# EAGLE design brauholic_v3.2 (EAGLE 6.4)
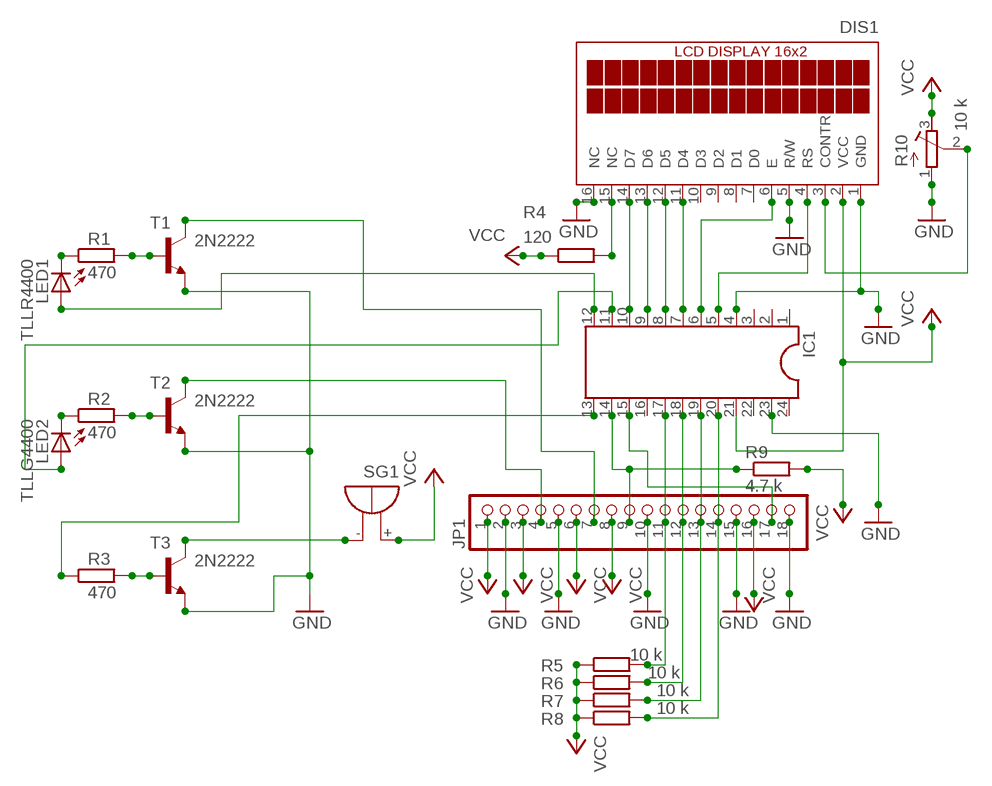
[diagram p0: schematic, sheet 1]

## Parts
DIS1  TUXGR_16X2_R2  [TUXGR_16X2_R2]
IC1  DIL24-6  [DIL24-6]
JP1  PINHD-1X18  [1X18]
LED1  TLLR4400  [LED3MM]
LED2  TLLG4400  [LED3MM]
R1  470  R-EU_0207/10  [0207/10]
R2  470  R-EU_0207/10  [0207/10]
R3  470  R-EU_0207/12  [0207/12]
R4  120  R-EU_0207/10  [0207/10]
R5  10 k  R-EU_0207/10  [0207/10]
R6  10 k  R-EU_0207/10  [0207/10]
R7  10 k  R-EU_0207/10  [0207/10]
R8  10 k  R-EU_0207/10  [0207/10]
R9  4.7 k  R-EU_0207/12  [0207/12]
R10  10 k  R-TRIMM3339P  [RTRIM3339P]
SG1  F/TMB  [F/TMB]
T1  2N2222  -NPN-TO92-EBC  [TO92-EBC]
T2  2N2222  -NPN-TO92-EBC  [TO92-EBC]
T3  2N2222  -NPN-TO92-EBC  [TO92-EBC]

## Nets
GND: DIS1.1(GND) DIS1.5(R/W) DIS1.16(NC) IC1.4 IC1.23 JP1.2 JP1.5 JP1.10 JP1.15 JP1.18 R10.1(E) T1.E T2.E T3.E
N$1: R1.2 T1.B
N$2: R2.2 T2.B
N$3: R3.2 T3.B
N$4: IC1.12 LED1.A
N$5: LED1.K(C) R1.1
N$6: IC1.13 R3.1
N$7: DIS1.14(D7) IC1.10
N$8: DIS1.13(D6) IC1.9
N$9: DIS1.12(D5) IC1.8
N$10: DIS1.11(D4) IC1.7
N$11: SG1.- T3.C
N$12: IC1.11 LED2.A
N$13: LED2.K(C) R2.1
N$14: JP1.7 T1.C
N$15: JP1.4 T2.C
N$16: IC1.14 JP1.9 R9.1
N$17: DIS1.15(NC) R4.2
N$18: IC1.18 JP1.12 R6.2
N$19: DIS1.3(CONTR) R10.2(S)
N$20: IC1.17 JP1.11 R5.2
N$21: IC1.15 JP1.17
N$22: IC1.19 JP1.13 R7.2
N$23: IC1.20 JP1.14 R8.2
N$25: DIS1.6(E) IC1.6
N$26: DIS1.4(RS) IC1.5
VCC: DIS1.2(VCC) IC1.21 JP1.1 JP1.3 JP1.6 JP1.8 JP1.16 R4.1 R5.1 R6.1 R7.1 R8.1 R9.2 R10.3(A) SG1.+
Unconnected: DIS1.7(D0) DIS1.8(D1) DIS1.9(D2) DIS1.10(D3) IC1.1 IC1.2 IC1.3 IC1.16 IC1.22 IC1.24

## Library data of the parts
DIS1 = display-lcd_2:TUXGR_16X2_R2: Tuxgraphics LCD display 16x2 characters reflective, without background light Source: tuxgr_12x2_r2.pdf; OC_FARNELL: unknown; OC_NEWARK: unknown
IC1 = ic-package:DIL24: Dual In Line
JP1 = pinhead:PINHD-1X18: PIN HEADER
LED1 = led:TLLR4400: Low Current (2mA) LED 3 mm Tinted Diffused Package color RED Source: Data sheet <http://www.farnell.com/datasheets/391100.pdf>; MF: VISHAY SEMICONDUCTOR; OC_FARNELL: 1612437
LED2 = led:TLLG4400: Low Current (2mA) LED 3 mm Tinted Diffused Package color GREEN Source: Data sheet <http://www.farnell.com/datasheets/391098.pdf>; MF: VISHAY SEMICONDUCTOR; OC_FARNELL: 1612435
R1-R9 = resistor:R-EU_: RESISTOR, European symbol
R10 = resistor:R-TRIMM: Trimm resistor
SG1 = buzzer:F/TMB: BUZZER Source: Buerklin; OC_FARNELL: unknown; OC_NEWARK: unknown
T1-T3 = transistor:*-NPN-: NPN Transistror BF959 corrected 2008.03.06

## Board
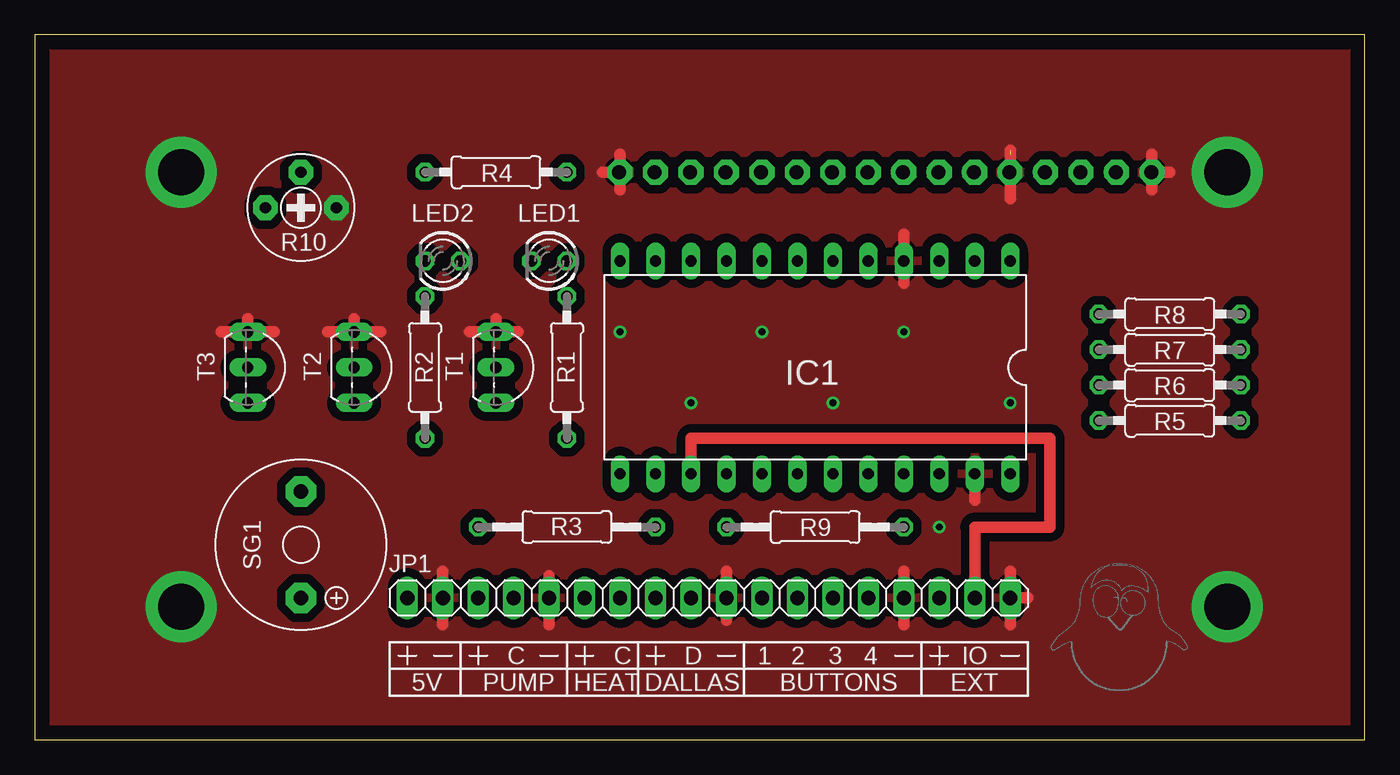
[diagram p1: board, top side]
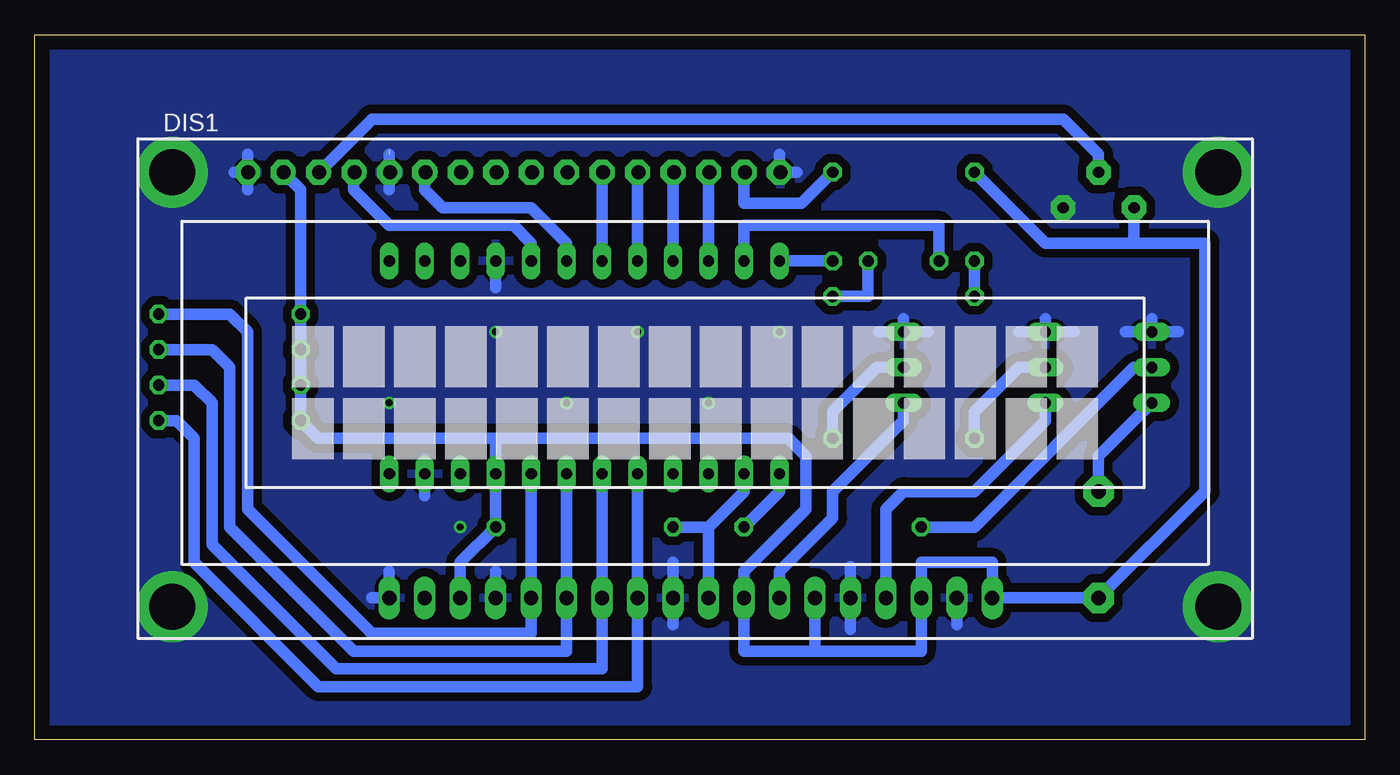
[diagram p2: board, bottom side, seen from below]

Size 95.23 x 50.47 mm. Coordinates in mm from the lower left corner, seen from the top.
Outline: 0,0 95.23,0 95.23,50.47 0,50.47 0,0
Copper layers (1*16): Top 0.035mm / dielectric 1.5mm / Bottom 0.035mm
Design rules "default *": minimum track width 10mil, minimum drill 24mil, track to track 25mil, track to pad 25mil, pad to pad 25mil, via to via 25mil, smd to smd 8mil, copper to edge 40mil, drill to drill 8mil, minimum pad ring 10mil, minimum via ring 8mil, stop-mask expansion 4mil, vias tented up to drill 0mil, thermal gap 10mil

### Footprints (pad centres in the part's own frame; a part is rotated, then mirrored left to right if it is on the bottom)
TUXGR_16X2_R2 = drill 1 pad 1.676: 1 -32,15.5; 2 -29.46,15.5; 3 -26.92,15.5; 4 -24.38,15.5; 5 -21.84,15.5; 6 -19.3,15.5; 7 -16.76,15.5; 8 -14.22,15.5; 9 -11.68,15.5; 10 -9.14,15.5; 11 -6.6,15.5; 12 -4.06,15.5; 13 -1.52,15.5; 14 1.02,15.5; 15 3.56,15.5; 16 6.1,15.5
DIL24-6 = drill 0.813 long: 1 -13.97,-7.62; 2 -11.43,-7.62; 3 -8.89,-7.62; 4 -6.35,-7.62; 5 -3.81,-7.62; 6 -1.27,-7.62; 7 1.27,-7.62; 8 3.81,-7.62; 9 6.35,-7.62; 10 8.89,-7.62; 11 11.43,-7.62; 12 13.97,-7.62; 13 13.97,7.62; 14 11.43,7.62; 15 8.89,7.62; 16 6.35,7.62; 17 3.81,7.62; 18 1.27,7.62; 19 -1.27,7.62; 20 -3.81,7.62; 21 -6.35,7.62; 22 -8.89,7.62; 23 -11.43,7.62; 24 -13.97,7.62
1X18 = drill 1.016 long: 1 -21.59,0; 2 -19.05,0; 3 -16.51,0; 4 -13.97,0; 5 -11.43,0; 6 -8.89,0; 7 -6.35,0; 8 -3.81,0; 9 -1.27,0; 10 1.27,0; 11 3.81,0; 12 6.35,0; 13 8.89,0; 14 11.43,0; 15 13.97,0; 16 16.51,0; 17 19.05,0; 18 21.59,0
LED3MM = drill 0.813 octagon: A -1.27,0; K 1.27,0
0207/10 = drill 0.813 octagon: 1 -5.08,0; 2 5.08,0
0207/12 = drill 0.813 octagon: 1 -6.35,0; 2 6.35,0
RTRIM3339P = drill 0.61: 1 -2.54,0; 2 0,-2.54; 3 2.54,0
F/TMB = drill 1.016 pad 2.159 octagon: + 3.81,0; - -3.81,0
TO92-EBC = drill 0.813 long: B 0,-1.27; C 2.54,-1.27; E -2.54,-1.27

### Placement (x,y rotation side)
DIS1  47.94,25.15 0 bottom
IC1  55.88,26.67 180 top
JP1  48.26,10.16 0 top
LED1  36.83,34.29 180 top
LED2  29.21,34.29 180 top
R1  38.1,26.67 270 top
R2  27.94,26.67 270 top
R3  38.1,15.24 180 top
R4  33.02,40.64 0 top
R5  81.28,22.86 0 top
R6  81.28,25.4 0 top
R7  81.28,27.94 0 top
R8  81.28,30.48 0 top
R9  55.88,15.24 0 top
R10  19.05,38.1 180 top
SG1  19.05,13.97 270 top
T1  34.29,26.67 270 top
T2  24.13,26.67 270 top
T3  16.51,26.67 270 top

### Tracks (layer width: path | path; a pad name or v marks a point on that pad's centre or on a via)
GND  (via drill 0.5, 0.8 pad 1.78, 3.3 pad 5.08)  (1 unrouted)
  Top 0.813: 49.53,8.57 49.53,12.06 | 36.83,8.26 36.83,11.75 | 69.85,38.73 69.85,42.23 | 13.34,29.21 T3.E | T3.E 17.14,29.21 | T3.E 15.24,30.16 | 20.95,29.21 T2.E | T2.E 24.77,29.21 | T2.E 22.86,30.16 | 31.11,29.21 T1.E | T1.E 34.61,29.21 | T1.E 33.02,30.16 | 62.23,32.7 62.23,36.2 | 62.23,8.26 62.23,12.06 | v41.91,40.64 41.91,41.91 | 41.91,39.37 v41.91,40.64 | DIS1.16 40.64,40.64 | v41.91,40.64 DIS1.16 | DIS1.16 | IC1.23 67.31,17.14 | v80.01,40.64 80.01,41.91 | v80.01,40.64 80.01,39.37 | v80.01,40.64 81.28,40.64 | v80.01,40.64 DIS1.1 | JP1.18 69.85,12.06 | 69.85,8.26 JP1.18 | JP1.18 71.12,10.16 | 29.21,8.26 29.21,12.06
  Bottom 0.813: 29.21,8.26 JP1.2 | 49.53,8.26 49.53,12.7 | 36.83,7.94 36.83,12.38 | T3.E 13.34,29.21 | T3.E 17.14,29.21 | T2.E 20.8,29.21 | T2.E 24.77,29.21 | T2.E 22.86,30.16 | T1.E 31.27,29.21 | T1.E 34.77,29.21 | T1.E 33.02,30.16 | 62.23,32.38 IC1.4 | JP1.15 62.23,12.06 | 69.85,12.06 JP1.18 71.12,10.16 | v69.85,40.64 DIS1.5 | T3.E 15.24,30.16 | 67.31,17.46 IC1.23 | 69.85,39.37 69.85,41.91 | 80.01,39.37 v80.01,40.64 | v80.01,40.64 80.01,41.91 | v80.01,40.64 80.96,40.64 | 41.91,41.91 v41.91,40.64 40.64,40.64
  other vias: 21.59,38.1 41.91,29.21 46.99,24.13 52.07,29.21 57.15,24.13 62.23,29.21 69.85,24.13 64.77,15.24 10.48,40.64 10.48,9.53 85.41,40.64 85.41,9.53
  pour Bottom: 1.27,49.21 93.98,49.21 93.98,1.27 1.27,1.27
  pour Top: 1.27,49.21 1.27,1.27 93.98,1.27 93.98,49.21
N$1
  Bottom 0.813: T1.B 34.92,26.67 38.1,23.5 R1.2
N$2
  Bottom 0.813: T2.B 24.77,26.67 27.94,23.5 R2.2
N$3
  Bottom 0.813: R3.2 27.94,15.24 16.51,26.67 T3.B
N$4
  Bottom 0.813: LED1.A IC1.12
N$5
  Bottom 0.813: LED1.K 35.56,31.75 R1.1
N$6
  Bottom 0.813: IC1.13 41.91,17.78 R3.1
N$7  (via drill 0.8 pad 1.78)
  Bottom 0.61: DIS1.14 v46.98,40.65 v46.99,40.64
  Bottom 0.813: IC1.10 46.99,40.58 DIS1.14
N$8  (via drill 0.8 pad 1.78)
  Bottom 0.61: v49.53,40.64 DIS1.13
  Bottom 0.813: IC1.9 49.53,40.58 DIS1.13
N$9  (via drill 0.8 pad 1.78)
  Bottom 0.61: v52.07,40.64 DIS1.12
  Bottom 0.813: IC1.8 52.07,40.58 DIS1.12
N$10  (via drill 0.8 pad 1.78)
  Bottom 0.61: v54.61,40.64 DIS1.11
  Bottom 0.813: IC1.7 54.61,40.58 DIS1.11
N$11
  Bottom 0.813: T3.C 19.05,20.32 SG1.-
N$12
  Bottom 0.813: IC1.11 44.45,36.83 30.48,36.83 LED2.A
N$13
  Bottom 0.813: R2.1 LED2.K
N$14
  Bottom 0.813: 41.91,9.53 JP1.7 41.91,12.06 38.1,15.88 38.1,17.78 33.02,22.86 T1.C
N$15
  Bottom 0.813: JP1.4 34.29,16.51 33.02,17.78 27.94,17.78 22.86,22.86 T2.C
N$16
  Bottom 0.813: IC1.14 44.45,17.78 46.99,15.24 | JP1.9 46.99,15.24 | 46.99,15.24 R9.1
N$17  (via drill 0.8 pad 1.78)
  Bottom 0.61: v44.45,40.64 DIS1.15
  Bottom 0.813: R4.2 40.32,38.42 44.45,38.42 44.45,40.58 DIS1.15
N$18
  Bottom 0.813: JP1.12 IC1.18 54.61,5.08 73.66,5.08 82.55,13.97 82.55,24.13 83.82,25.4 R6.2
N$19  (via drill 0.8 pad 1.78)
  Bottom 0.813: v74.93,40.64 DIS1.3 71.12,44.39 71.12,44.45 21.59,44.45 19.05,41.91 R10.2
  other vias: 19.05,40.64
N$20
  Bottom 0.813: JP1.11 IC1.17 52.07,3.81 74.93,3.81 83.82,12.7 83.82,21.59 85.09,22.86 R5.2
N$21
  Top 0.813: JP1.17 67.31,15.24 72.71,15.24 72.71,21.59 46.99,21.59 IC1.15
N$22
  Bottom 0.813: JP1.13 IC1.19 57.15,6.35 72.39,6.35 81.28,15.24 81.28,26.67 82.55,27.94 R7.2
N$23
  Bottom 0.813: JP1.14 IC1.20 59.69,7.62 71.12,7.62 80.01,16.51 80.01,29.21 81.28,30.48 R8.2
N$25  (via drill 0.8 pad 1.78)
  Bottom 0.61: v67.31,40.64 DIS1.6
  Bottom 0.813: IC1.6 57.15,35.56 59.69,38.1 66.04,38.1 67.31,39.37 67.31,40.58 DIS1.6
N$26  (via drill 0.8 pad 1.78)
  Bottom 0.813: IC1.5 59.69,35.56 60.96,36.83 69.85,36.83 72.39,39.37 v72.39,40.64 DIS1.4
N$36  (via drill 0.8 pad 1.78)
  other vias: 57.15,40.64
N$39  (via drill 0.8 pad 1.78)
  other vias: 59.69,40.64
N$40  (via drill 0.8 pad 1.78)
  other vias: 62.23,40.64
N$41  (via drill 0.8 pad 1.78)
  other vias: 64.77,40.64
VCC  (via drill 0.8 pad 1.78)
  Bottom 0.61: v77.47,40.64 DIS1.2
  Bottom 0.813: 39.37,6.35 JP1.6 | 39.37,6.35 44.45,6.35 JP1.8 44.45,12.06 40.01,16.51 40.01,20.32 41.27,21.59 62.23,21.59 | R4.1 22.86,35.56 16.51,35.56 | 16.51,35.56 R10.3 | DIS1.2 77.4,40.57 76.2,39.37 R8.1 R7.1 R6.1 R5.1 74.93,21.59 62.23,21.59 | 39.37,6.35 31.75,6.35 JP1.3 31.75,12.7 26.67,12.7 JP1.1 SG1.+ 11.43,17.78 11.43,35.56 16.51,35.56 | JP1.16 64.77,12.7 R9.2 IC1.21 62.23,21.59
  other vias: 16.51,38.1

### Text on the board
tNames: C | C | D | 1 | 2 | 3 | 4 | IO | 5V | PUMP | HEAT | DALLAS | BUTTONS | EXT
tDocu: Version 3.2 | HBP | www.hbpro.ru
201bmp: C:/Users/rvstruko/Desktop/Tux-G2.bmp